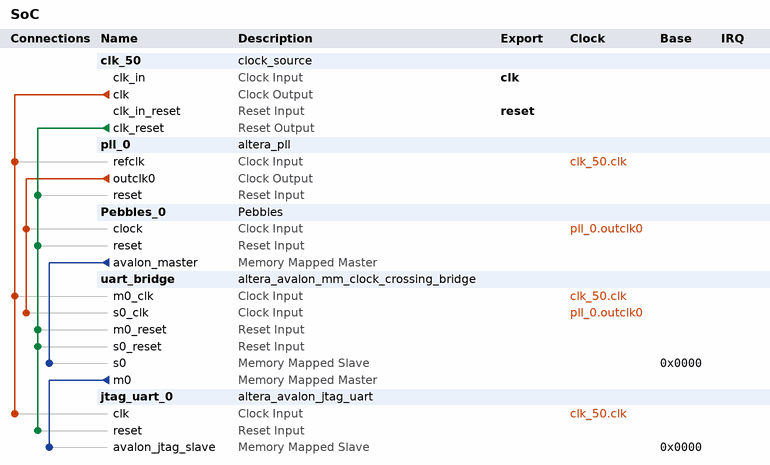
[diagram p0: system contents]
# Platform Designer (Qsys) system SoC, Stratix V 5SGXEA7N2F45C2
# Parameters at their usual value, and those the tool derives, are not listed.
package require -exact qsys 16.1
create_system SoC
set_project_property DEVICE_FAMILY {Stratix V}
set_project_property DEVICE 5SGXEA7N2F45C2

add_instance clk_50 clock_source 16.1
set_instance_parameter_value clk_50 clockFrequency 50000000

add_instance pll_0 altera_pll 16.1
set_instance_parameter_value pll_0 gui_device_speed_grade 1
set_instance_parameter_value pll_0 gui_number_of_clocks 1
set_instance_parameter_value pll_0 gui_operation_mode direct
set_instance_parameter_value pll_0 gui_output_clock_frequency0 230.0
set_instance_parameter_value pll_0 gui_pll_mode {Integer-N PLL}
set_instance_parameter_value pll_0 gui_reference_clock_frequency 50.0
set_instance_parameter_value pll_0 gui_use_locked true

add_instance Pebbles_0 Pebbles 1.0

add_instance uart_bridge altera_avalon_mm_clock_crossing_bridge 16.1
set_instance_parameter_value uart_bridge ADDRESS_WIDTH 10
set_instance_parameter_value uart_bridge COMMAND_FIFO_DEPTH 4
set_instance_parameter_value uart_bridge DATA_WIDTH 32
set_instance_parameter_value uart_bridge MASTER_SYNC_DEPTH 2
set_instance_parameter_value uart_bridge MAX_BURST_SIZE 1
set_instance_parameter_value uart_bridge RESPONSE_FIFO_DEPTH 4
set_instance_parameter_value uart_bridge SLAVE_SYNC_DEPTH 2
set_instance_parameter_value uart_bridge USE_AUTO_ADDRESS_WIDTH 1

add_instance jtag_uart_0 altera_avalon_jtag_uart 16.1
set_instance_parameter_value jtag_uart_0 simInteractiveOptions NO_INTERACTIVE_WINDOWS

# connections
add_connection clk_50.clk jtag_uart_0.clk clock
add_connection clk_50.clk pll_0.refclk clock
add_connection clk_50.clk uart_bridge.m0_clk clock
add_connection pll_0.outclk0 Pebbles_0.clock clock
add_connection pll_0.outclk0 uart_bridge.s0_clk clock
add_connection clk_50.clk_reset jtag_uart_0.reset reset
add_connection clk_50.clk_reset Pebbles_0.reset reset
add_connection clk_50.clk_reset pll_0.reset reset
add_connection clk_50.clk_reset uart_bridge.m0_reset reset
add_connection clk_50.clk_reset uart_bridge.s0_reset reset
add_connection Pebbles_0.avalon_master uart_bridge.s0 avalon
set_connection_parameter_value Pebbles_0.avalon_master/uart_bridge.s0 baseAddress 0x0000
add_connection uart_bridge.m0 jtag_uart_0.avalon_jtag_slave avalon
set_connection_parameter_value uart_bridge.m0/jtag_uart_0.avalon_jtag_slave baseAddress 0x0000

# exported interfaces
add_interface clk clock sink
set_interface_property clk EXPORT_OF clk_50.clk_in
add_interface reset reset sink
set_interface_property reset EXPORT_OF clk_50.clk_in_reset

set_interconnect_requirement {$system} qsys_mm.clockCrossingAdapter FIFO
set_interconnect_requirement {$system} qsys_mm.maxAdditionalLatency 4

save_system SoC.qsys
